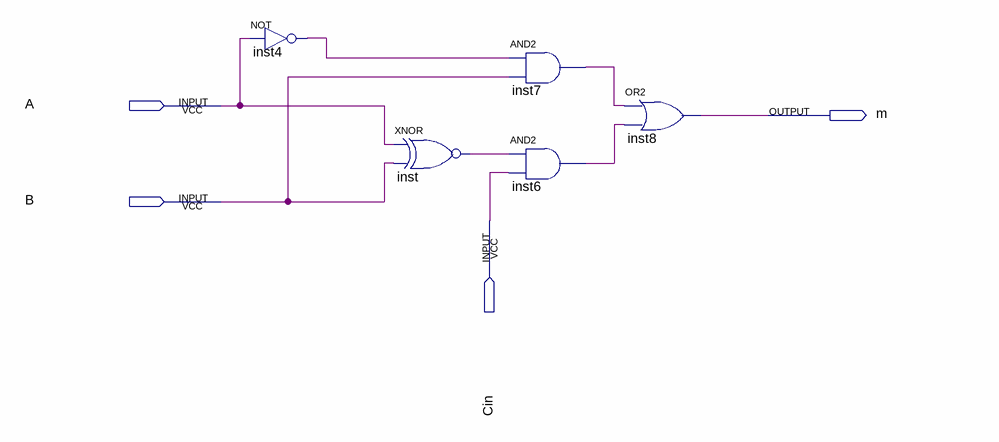
[diagram p0: schematic sheet]
// Quartus schematic Menor-que-1-bit.bdf as structural Verilog: 5 symbols, 4 pins
module \Menor-que-1-bit  (
  input  A,
  input  B,
  input  Cin,
  output m
);

  wire inst4_out, inst6_out, inst7_out, inst_out;

  not inst4 (inst4_out, A);
  xnor inst (inst_out, A, B);
  and inst7 (inst7_out, inst4_out, B);
  and inst6 (inst6_out, inst_out, Cin);
  or inst8 (m, inst7_out, inst6_out);
endmodule
